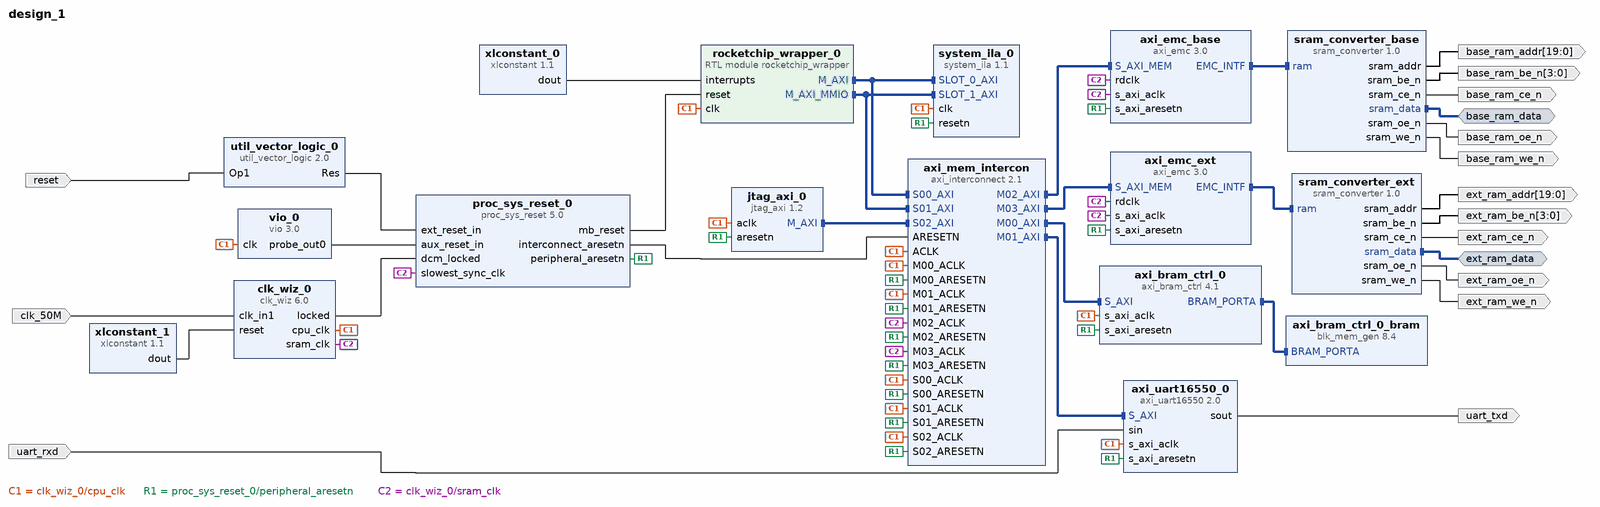
[diagram p0: block diagram of the top level]
# Vivado block design design_1, xc7a100tfgg676-2L, Vivado 2018.3
create_bd_design design_1

create_bd_intf_port -mode Master -vlnv xilinx.com:interface:gpio_rtl:1.0 base_ram_data
create_bd_intf_port -mode Master -vlnv xilinx.com:interface:gpio_rtl:1.0 ext_ram_data
create_bd_port -dir I -type clk clk_50M
set_property -dict {CONFIG.FREQ_HZ 50000000} [get_bd_ports clk_50M]
create_bd_port -dir I -type rst reset
set_property -dict {CONFIG.POLARITY ACTIVE_HIGH} [get_bd_ports reset]
create_bd_port -dir O -from 3 -to 0 base_ram_be_n
create_bd_port -dir O -from 19 -to 0 base_ram_addr
create_bd_port -dir O base_ram_oe_n
create_bd_port -dir O base_ram_ce_n
create_bd_port -dir O base_ram_we_n
create_bd_port -dir O ext_ram_oe_n
create_bd_port -dir O -from 19 -to 0 ext_ram_addr
create_bd_port -dir O ext_ram_ce_n
create_bd_port -dir O -from 3 -to 0 ext_ram_be_n
create_bd_port -dir O ext_ram_we_n
create_bd_port -dir I uart_rxd
create_bd_port -dir O uart_txd

create_bd_cell -type ip -vlnv xilinx.com:ip:axi_bram_ctrl:4.1 axi_bram_ctrl_0
set_property -dict {CONFIG.SINGLE_PORT_BRAM 1} [get_bd_cells axi_bram_ctrl_0]
create_bd_cell -type ip -vlnv xilinx.com:ip:blk_mem_gen:8.4 axi_bram_ctrl_0_bram
set_property -dict {CONFIG.Memory_Type Single_Port_RAM CONFIG.Port_A_Write_Rate 50} [get_bd_cells axi_bram_ctrl_0_bram]
create_bd_cell -type ip -vlnv xilinx.com:ip:clk_wiz:6.0 clk_wiz_0
set_property -dict [list \
  CONFIG.CLKIN1_JITTER_PS 200.0 \
  CONFIG.CLKOUT1_JITTER 192.113 \
  CONFIG.CLKOUT1_PHASE_ERROR 164.985 \
  CONFIG.CLKOUT1_REQUESTED_OUT_FREQ 50.000 \
  CONFIG.CLKOUT2_JITTER 285.743 \
  CONFIG.CLKOUT2_PHASE_ERROR 164.985 \
  CONFIG.CLKOUT2_REQUESTED_OUT_FREQ 10.000 \
  CONFIG.CLKOUT2_USED true \
  CONFIG.CLK_OUT1_PORT cpu_clk \
  CONFIG.CLK_OUT2_PORT sram_clk \
  CONFIG.MMCM_CLKFBOUT_MULT_F 20.000 \
  CONFIG.MMCM_CLKIN1_PERIOD 20.000 \
  CONFIG.MMCM_CLKIN2_PERIOD 10.0 \
  CONFIG.MMCM_CLKOUT0_DIVIDE_F 20.000 \
  CONFIG.MMCM_CLKOUT1_DIVIDE 100 \
  CONFIG.MMCM_DIVCLK_DIVIDE 1 \
  CONFIG.NUM_OUT_CLKS 2 \
  CONFIG.PRIM_IN_FREQ 50.000 \
] [get_bd_cells clk_wiz_0]
create_bd_cell -type ip -vlnv xilinx.com:ip:proc_sys_reset:5.0 proc_sys_reset_0
create_bd_cell -type ip -vlnv xilinx.com:ip:axi_interconnect:2.1 axi_mem_intercon
set_property -dict {CONFIG.NUM_MI 4 CONFIG.NUM_SI 3} [get_bd_cells axi_mem_intercon]
create_bd_cell -type ip -vlnv xilinx.com:ip:vio:3.0 vio_0
set_property -dict {CONFIG.C_NUM_PROBE_IN 0 CONFIG.C_PROBE_OUT0_INIT_VAL 0x1} [get_bd_cells vio_0]
create_bd_cell -type ip -vlnv xilinx.com:ip:xlconstant:1.1 xlconstant_0
set_property -dict {CONFIG.CONST_VAL 0 CONFIG.CONST_WIDTH 2} [get_bd_cells xlconstant_0]
create_bd_cell -type ip -vlnv xilinx.com:ip:system_ila:1.1 system_ila_0
set_property -dict [list \
  CONFIG.C_MON_TYPE INTERFACE \
  CONFIG.C_NUM_MONITOR_SLOTS 2 \
  CONFIG.C_SLOT_0_APC_EN 0 \
  CONFIG.C_SLOT_0_AXI_AR_SEL_DATA 1 \
  CONFIG.C_SLOT_0_AXI_AR_SEL_TRIG 1 \
  CONFIG.C_SLOT_0_AXI_AW_SEL_DATA 1 \
  CONFIG.C_SLOT_0_AXI_AW_SEL_TRIG 1 \
  CONFIG.C_SLOT_0_AXI_B_SEL_DATA 1 \
  CONFIG.C_SLOT_0_AXI_B_SEL_TRIG 1 \
  CONFIG.C_SLOT_0_AXI_R_SEL_DATA 1 \
  CONFIG.C_SLOT_0_AXI_R_SEL_TRIG 1 \
  CONFIG.C_SLOT_0_AXI_W_SEL_DATA 1 \
  CONFIG.C_SLOT_0_AXI_W_SEL_TRIG 1 \
  CONFIG.C_SLOT_0_INTF_TYPE xilinx.com:interface:aximm_rtl:1.0 \
  CONFIG.C_SLOT_1_APC_EN 0 \
  CONFIG.C_SLOT_1_AXI_AR_SEL_DATA 1 \
  CONFIG.C_SLOT_1_AXI_AR_SEL_TRIG 1 \
  CONFIG.C_SLOT_1_AXI_AW_SEL_DATA 1 \
  CONFIG.C_SLOT_1_AXI_AW_SEL_TRIG 1 \
  CONFIG.C_SLOT_1_AXI_B_SEL_DATA 1 \
  CONFIG.C_SLOT_1_AXI_B_SEL_TRIG 1 \
  CONFIG.C_SLOT_1_AXI_R_SEL_DATA 1 \
  CONFIG.C_SLOT_1_AXI_R_SEL_TRIG 1 \
  CONFIG.C_SLOT_1_AXI_W_SEL_DATA 1 \
  CONFIG.C_SLOT_1_AXI_W_SEL_TRIG 1 \
  CONFIG.C_SLOT_1_INTF_TYPE xilinx.com:interface:aximm_rtl:1.0 \
] [get_bd_cells system_ila_0]
create_bd_cell -type ip -vlnv xilinx.com:ip:xlconstant:1.1 xlconstant_1
set_property -dict {CONFIG.CONST_VAL 0} [get_bd_cells xlconstant_1]
create_bd_cell -type ip -vlnv xilinx.com:ip:util_vector_logic:2.0 util_vector_logic_0
set_property -dict {CONFIG.C_OPERATION not CONFIG.C_SIZE 1} [get_bd_cells util_vector_logic_0]
create_bd_cell -type ip -vlnv xilinx.com:ip:axi_emc:3.0 axi_emc_base
set_property -dict [list \
  CONFIG.C_INCLUDE_DATAWIDTH_MATCHING_0 0 \
  CONFIG.C_MAX_MEM_WIDTH 32 \
  CONFIG.C_MEM0_TYPE 1 \
  CONFIG.C_MEM0_WIDTH 32 \
] [get_bd_cells axi_emc_base]
create_bd_cell -type ip -vlnv xilinx.com:ip:axi_emc:3.0 axi_emc_ext
set_property -dict [list \
  CONFIG.C_INCLUDE_DATAWIDTH_MATCHING_0 0 \
  CONFIG.C_MAX_MEM_WIDTH 32 \
  CONFIG.C_MEM0_TYPE 1 \
  CONFIG.C_MEM0_WIDTH 32 \
] [get_bd_cells axi_emc_ext]
create_bd_cell -type ip -vlnv xilinx.com:ip:jtag_axi:1.2 jtag_axi_0
create_bd_cell -type ip -vlnv jiegec.me:user:sram_converter:1.0 sram_converter_base
create_bd_cell -type ip -vlnv jiegec.me:user:sram_converter:1.0 sram_converter_ext
create_bd_cell -type ip -vlnv xilinx.com:ip:axi_uart16550:2.0 axi_uart16550_0
set_property -dict {CONFIG.C_HAS_EXTERNAL_RCLK 0} [get_bd_cells axi_uart16550_0]
create_bd_cell -type module -reference rocketchip_wrapper rocketchip_wrapper_0

# ---- connections ----

connect_bd_intf_net [get_bd_intf_pins axi_mem_intercon/M01_AXI] [get_bd_intf_pins axi_uart16550_0/S_AXI]
connect_bd_intf_net [get_bd_intf_pins axi_mem_intercon/M02_AXI] [get_bd_intf_pins axi_emc_base/S_AXI_MEM]
connect_bd_intf_net -intf_net sram_converter_0_sram_data [get_bd_intf_ports base_ram_data] [get_bd_intf_pins sram_converter_base/sram_data]
connect_bd_intf_net [get_bd_intf_pins axi_mem_intercon/M03_AXI] [get_bd_intf_pins axi_emc_ext/S_AXI_MEM]
connect_bd_intf_net [get_bd_intf_pins jtag_axi_0/M_AXI] [get_bd_intf_pins axi_mem_intercon/S02_AXI]
connect_bd_intf_net [get_bd_intf_pins sram_converter_base/ram] [get_bd_intf_pins axi_emc_base/EMC_INTF]
connect_bd_intf_net -intf_net rocketchip_wrapper_0_M_AXI [get_bd_intf_pins rocketchip_wrapper_0/M_AXI] [get_bd_intf_pins axi_mem_intercon/S00_AXI]
connect_bd_intf_net [get_bd_intf_pins rocketchip_wrapper_0/M_AXI] [get_bd_intf_pins system_ila_0/SLOT_0_AXI]
connect_bd_intf_net [get_bd_intf_pins axi_bram_ctrl_0_bram/BRAM_PORTA] [get_bd_intf_pins axi_bram_ctrl_0/BRAM_PORTA]
connect_bd_intf_net -intf_net rocketchip_wrapper_0_M_AXI_MMIO [get_bd_intf_pins rocketchip_wrapper_0/M_AXI_MMIO] [get_bd_intf_pins axi_mem_intercon/S01_AXI]
connect_bd_intf_net [get_bd_intf_pins rocketchip_wrapper_0/M_AXI_MMIO] [get_bd_intf_pins system_ila_0/SLOT_1_AXI]
connect_bd_intf_net [get_bd_intf_pins axi_mem_intercon/M00_AXI] [get_bd_intf_pins axi_bram_ctrl_0/S_AXI]
connect_bd_intf_net -intf_net sram_converter_0_sram_data1 [get_bd_intf_ports ext_ram_data] [get_bd_intf_pins sram_converter_ext/sram_data]
connect_bd_intf_net [get_bd_intf_pins sram_converter_ext/ram] [get_bd_intf_pins axi_emc_ext/EMC_INTF]
connect_bd_net -net clk_1 [get_bd_ports clk_50M] [get_bd_pins clk_wiz_0/clk_in1]
connect_bd_net -net clk_wiz_0_clk_out1 [get_bd_pins clk_wiz_0/cpu_clk] \
  [get_bd_pins axi_bram_ctrl_0/s_axi_aclk] [get_bd_pins axi_mem_intercon/ACLK] [get_bd_pins axi_mem_intercon/S00_ACLK] \
  [get_bd_pins axi_mem_intercon/M00_ACLK] [get_bd_pins vio_0/clk] [get_bd_pins axi_mem_intercon/S01_ACLK] \
  [get_bd_pins system_ila_0/clk] [get_bd_pins axi_mem_intercon/M01_ACLK] [get_bd_pins jtag_axi_0/aclk] \
  [get_bd_pins axi_mem_intercon/S02_ACLK] [get_bd_pins axi_uart16550_0/s_axi_aclk] [get_bd_pins rocketchip_wrapper_0/clk]
connect_bd_net [get_bd_pins clk_wiz_0/locked] [get_bd_pins proc_sys_reset_0/dcm_locked]
connect_bd_net [get_bd_pins proc_sys_reset_0/peripheral_aresetn] \
  [get_bd_pins axi_bram_ctrl_0/s_axi_aresetn] [get_bd_pins axi_mem_intercon/S00_ARESETN] \
  [get_bd_pins axi_mem_intercon/M00_ARESETN] [get_bd_pins axi_mem_intercon/S01_ARESETN] [get_bd_pins system_ila_0/resetn] \
  [get_bd_pins axi_mem_intercon/M01_ARESETN] [get_bd_pins axi_emc_base/s_axi_aresetn] \
  [get_bd_pins axi_mem_intercon/M02_ARESETN] [get_bd_pins axi_emc_ext/s_axi_aresetn] \
  [get_bd_pins axi_mem_intercon/M03_ARESETN] [get_bd_pins jtag_axi_0/aresetn] [get_bd_pins axi_mem_intercon/S02_ARESETN] \
  [get_bd_pins axi_uart16550_0/s_axi_aresetn]
connect_bd_net [get_bd_pins proc_sys_reset_0/interconnect_aresetn] [get_bd_pins axi_mem_intercon/ARESETN]
connect_bd_net [get_bd_pins vio_0/probe_out0] [get_bd_pins proc_sys_reset_0/aux_reset_in]
connect_bd_net [get_bd_pins xlconstant_1/dout] [get_bd_pins clk_wiz_0/reset]
connect_bd_net [get_bd_ports reset] [get_bd_pins util_vector_logic_0/Op1]
connect_bd_net [get_bd_pins util_vector_logic_0/Res] [get_bd_pins proc_sys_reset_0/ext_reset_in]
connect_bd_net [get_bd_pins clk_wiz_0/sram_clk] \
  [get_bd_pins axi_emc_base/s_axi_aclk] [get_bd_pins proc_sys_reset_0/slowest_sync_clk] \
  [get_bd_pins axi_mem_intercon/M02_ACLK] [get_bd_pins axi_emc_base/rdclk] [get_bd_pins axi_emc_ext/s_axi_aclk] \
  [get_bd_pins axi_emc_ext/rdclk] [get_bd_pins axi_mem_intercon/M03_ACLK]
connect_bd_net -net sram_converter_0_sram_be_n [get_bd_pins sram_converter_base/sram_be_n] [get_bd_ports base_ram_be_n]
connect_bd_net -net sram_converter_0_sram_addr [get_bd_pins sram_converter_base/sram_addr] [get_bd_ports base_ram_addr]
connect_bd_net -net sram_converter_0_sram_oe_n [get_bd_pins sram_converter_base/sram_oe_n] [get_bd_ports base_ram_oe_n]
connect_bd_net -net sram_converter_0_sram_ce_n [get_bd_pins sram_converter_base/sram_ce_n] [get_bd_ports base_ram_ce_n]
connect_bd_net -net sram_converter_0_sram_we_n [get_bd_pins sram_converter_base/sram_we_n] [get_bd_ports base_ram_we_n]
connect_bd_net [get_bd_pins sram_converter_ext/sram_oe_n] [get_bd_ports ext_ram_oe_n]
connect_bd_net [get_bd_pins sram_converter_ext/sram_addr] [get_bd_ports ext_ram_addr]
connect_bd_net [get_bd_pins sram_converter_ext/sram_ce_n] [get_bd_ports ext_ram_ce_n]
connect_bd_net [get_bd_pins sram_converter_ext/sram_be_n] [get_bd_ports ext_ram_be_n]
connect_bd_net [get_bd_pins sram_converter_ext/sram_we_n] [get_bd_ports ext_ram_we_n]
connect_bd_net -net sin_0_1 [get_bd_ports uart_rxd] [get_bd_pins axi_uart16550_0/sin]
connect_bd_net [get_bd_pins axi_uart16550_0/sout] [get_bd_ports uart_txd]
connect_bd_net [get_bd_pins proc_sys_reset_0/mb_reset] [get_bd_pins rocketchip_wrapper_0/reset]
connect_bd_net [get_bd_pins xlconstant_0/dout] [get_bd_pins rocketchip_wrapper_0/interrupts]
set_property HDL_ATTRIBUTE.DEBUG true [get_bd_intf_nets rocketchip_wrapper_0_M_AXI]
set_property HDL_ATTRIBUTE.MARK_DEBUG true [get_bd_intf_nets rocketchip_wrapper_0_M_AXI]
set_property HDL_ATTRIBUTE.DEBUG true [get_bd_intf_nets rocketchip_wrapper_0_M_AXI_MMIO]
set_property HDL_ATTRIBUTE.MARK_DEBUG true [get_bd_intf_nets rocketchip_wrapper_0_M_AXI_MMIO]

# ---- address map ----
assign_bd_address -offset 0x60600000 -range 64K -target_address_space [get_bd_addr_spaces jtag_axi_0/Data] [get_bd_addr_segs axi_uart16550_0/S_AXI/Reg]
assign_bd_address -offset 0x80000000 -range 4M -target_address_space [get_bd_addr_spaces jtag_axi_0/Data] [get_bd_addr_segs axi_emc_base/S_AXI_MEM/Mem0]
assign_bd_address -offset 0x80400000 -range 4M -target_address_space [get_bd_addr_spaces jtag_axi_0/Data] [get_bd_addr_segs axi_emc_ext/S_AXI_MEM/Mem0]
assign_bd_address -offset 0x80800000 -range 32K -target_address_space [get_bd_addr_spaces jtag_axi_0/Data] [get_bd_addr_segs axi_bram_ctrl_0/S_AXI/Mem0]
assign_bd_address -offset 0x60600000 -range 64K -target_address_space [get_bd_addr_spaces rocketchip_wrapper_0/M_AXI] [get_bd_addr_segs axi_uart16550_0/S_AXI/Reg]
assign_bd_address -offset 0x80000000 -range 4M -target_address_space [get_bd_addr_spaces rocketchip_wrapper_0/M_AXI] [get_bd_addr_segs axi_emc_base/S_AXI_MEM/Mem0]
assign_bd_address -offset 0x80400000 -range 4M -target_address_space [get_bd_addr_spaces rocketchip_wrapper_0/M_AXI] [get_bd_addr_segs axi_emc_ext/S_AXI_MEM/Mem0]
assign_bd_address -offset 0x80800000 -range 32K -target_address_space [get_bd_addr_spaces rocketchip_wrapper_0/M_AXI] [get_bd_addr_segs axi_bram_ctrl_0/S_AXI/Mem0]
assign_bd_address -offset 0x60600000 -range 64K -target_address_space [get_bd_addr_spaces rocketchip_wrapper_0/M_AXI_MMIO] [get_bd_addr_segs axi_uart16550_0/S_AXI/Reg]
assign_bd_address -offset 0x80000000 -range 4M -target_address_space [get_bd_addr_spaces rocketchip_wrapper_0/M_AXI_MMIO] [get_bd_addr_segs axi_emc_base/S_AXI_MEM/Mem0]
assign_bd_address -offset 0x80400000 -range 4M -target_address_space [get_bd_addr_spaces rocketchip_wrapper_0/M_AXI_MMIO] [get_bd_addr_segs axi_emc_ext/S_AXI_MEM/Mem0]
assign_bd_address -offset 0x80800000 -range 32K -target_address_space [get_bd_addr_spaces rocketchip_wrapper_0/M_AXI_MMIO] [get_bd_addr_segs axi_bram_ctrl_0/S_AXI/Mem0]

validate_bd_design
save_bd_design
